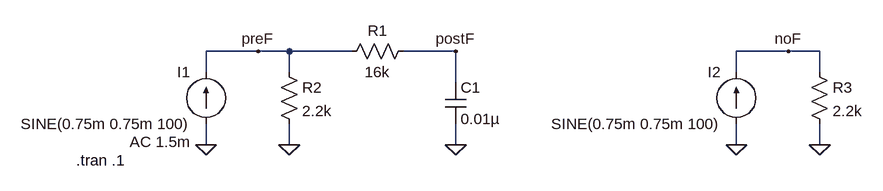
[diagram p0: schematic LowPass_LargeR_SmallC.asc]
LowPass_LargeR_SmallC.asc, the LTspice schematic file:
Version 4
SHEET 1 880 680
WIRE -176 96 -256 96
WIRE -128 96 -176 96
WIRE -32 96 -128 96
WIRE 128 96 48 96
WIRE 640 96 560 96
WIRE 688 96 640 96
WIRE -256 128 -256 96
WIRE -128 128 -128 96
WIRE 560 128 560 96
WIRE 688 128 688 96
WIRE 128 144 128 96
WIRE -256 240 -256 208
WIRE -128 240 -128 208
WIRE 128 240 128 208
WIRE 560 240 560 208
WIRE 688 240 688 208
FLAG -256 240 0
FLAG 128 240 0
FLAG -128 240 0
FLAG 560 240 0
FLAG 688 240 0
FLAG -176 96 preF
FLAG 128 96 postF
FLAG 640 96 noF
SYMBOL current -256 208 R180
WINDOW 0 24 80 Left 2
WINDOW 3 24 0 Left 2
WINDOW 123 24 -28 Left 2
WINDOW 39 0 0 Left 0
SYMATTR InstName I1
SYMATTR Value SINE(0.75m 0.75m 100)
SYMATTR Value2 AC 1.5m
SYMBOL res 64 80 R90
WINDOW 0 0 56 VBottom 2
WINDOW 3 32 56 VTop 2
SYMATTR InstName R1
SYMATTR Value 16k
SYMBOL cap 112 144 R0
SYMATTR InstName C1
SYMATTR Value 0.01µ
SYMBOL res -144 112 R0
SYMATTR InstName R2
SYMATTR Value 2.2k
SYMBOL current 560 208 R180
WINDOW 0 24 80 Left 2
WINDOW 3 24 0 Left 2
WINDOW 123 0 0 Left 0
WINDOW 39 0 0 Left 0
SYMATTR InstName I2
SYMATTR Value SINE(0.75m 0.75m 100)
SYMBOL res 672 112 R0
SYMATTR InstName R3
SYMATTR Value 2.2k
TEXT -456 264 Left 2 !.tran .1

The netlist it stands for:
* LowPass_LargeR_SmallC.asc
I1 0 preF SINE(0.75m 0.75m 100) AC 1.5m
R1 postF preF 16k
C1 postF 0 0.01µ
R2 preF 0 2.2k
I2 0 noF SINE(0.75m 0.75m 100)
R3 noF 0 2.2k
.tran .1
.backanno
.end